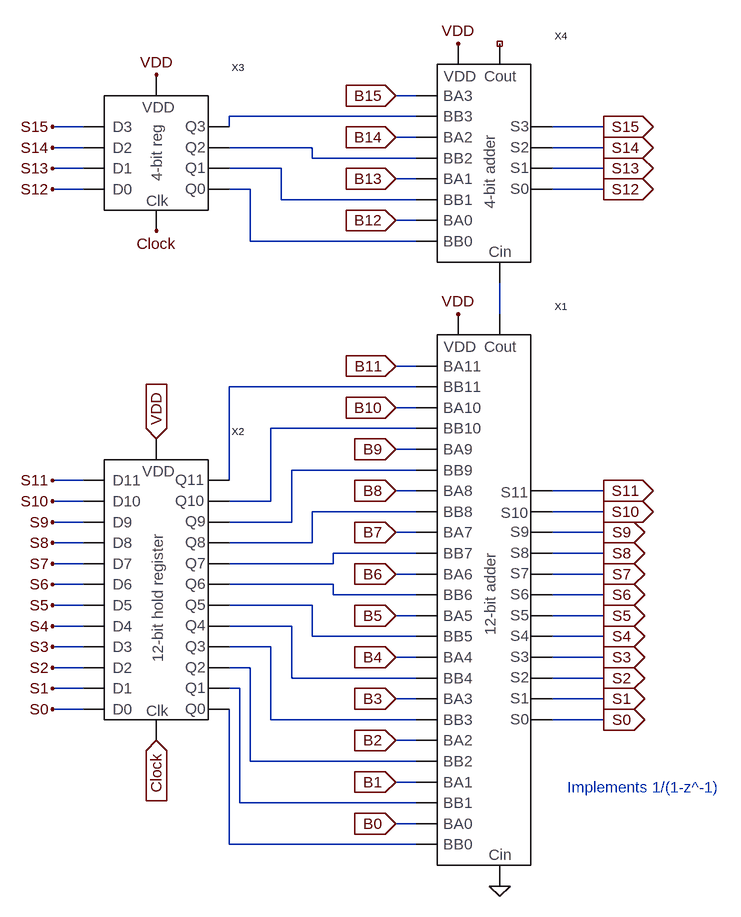
[diagram p0: schematic 16_bit_integrator.asc]
16_bit_integrator.asc, the LTspice schematic file:
Version 4
SHEET 1 1324 932
WIRE 112 -1456 80 -1456
WIRE 112 -1424 -176 -1424
WIRE -400 -1408 -448 -1408
WIRE -176 -1408 -176 -1424
WIRE 400 -1408 320 -1408
WIRE 112 -1392 80 -1392
WIRE -400 -1376 -448 -1376
WIRE -48 -1376 -176 -1376
WIRE 400 -1376 320 -1376
WIRE -48 -1360 -48 -1376
WIRE 112 -1360 -48 -1360
WIRE -400 -1344 -448 -1344
WIRE -96 -1344 -176 -1344
WIRE 400 -1344 320 -1344
WIRE 112 -1328 80 -1328
WIRE -400 -1312 -448 -1312
WIRE -144 -1312 -176 -1312
WIRE 400 -1312 320 -1312
WIRE -96 -1296 -96 -1344
WIRE 112 -1296 -96 -1296
WIRE 112 -1264 80 -1264
WIRE -144 -1232 -144 -1312
WIRE 112 -1232 -144 -1232
WIRE 240 -1120 240 -1168
WIRE 112 -1040 80 -1040
WIRE 112 -1008 -176 -1008
WIRE 112 -976 80 -976
WIRE 112 -944 -112 -944
WIRE 112 -912 80 -912
WIRE 112 -880 -80 -880
WIRE -400 -864 -448 -864
WIRE -176 -864 -176 -1008
WIRE 112 -848 80 -848
WIRE 400 -848 320 -848
WIRE -400 -832 -448 -832
WIRE -112 -832 -112 -944
WIRE -112 -832 -176 -832
WIRE 112 -816 -48 -816
WIRE 400 -816 320 -816
WIRE -400 -800 -448 -800
WIRE -80 -800 -80 -880
WIRE -80 -800 -176 -800
WIRE 112 -784 80 -784
WIRE 400 -784 320 -784
WIRE -400 -768 -448 -768
WIRE -48 -768 -48 -816
WIRE -48 -768 -176 -768
WIRE 112 -752 -16 -752
WIRE 400 -752 320 -752
WIRE -400 -736 -448 -736
WIRE -16 -736 -16 -752
WIRE -16 -736 -176 -736
WIRE 112 -720 80 -720
WIRE 400 -720 320 -720
WIRE -400 -704 -448 -704
WIRE -16 -704 -176 -704
WIRE -16 -688 -16 -704
WIRE 112 -688 -16 -688
WIRE 400 -688 320 -688
WIRE -400 -672 -448 -672
WIRE -48 -672 -176 -672
WIRE 112 -656 80 -656
WIRE 400 -656 320 -656
WIRE -400 -640 -448 -640
WIRE -80 -640 -176 -640
WIRE -48 -624 -48 -672
WIRE 112 -624 -48 -624
WIRE 400 -624 320 -624
WIRE -400 -608 -448 -608
WIRE -112 -608 -176 -608
WIRE 112 -592 80 -592
WIRE 400 -592 320 -592
WIRE -400 -576 -448 -576
WIRE -144 -576 -176 -576
WIRE -80 -560 -80 -640
WIRE 112 -560 -80 -560
WIRE 400 -560 320 -560
WIRE -400 -544 -448 -544
WIRE -160 -544 -176 -544
WIRE 112 -528 80 -528
WIRE 400 -528 320 -528
WIRE -400 -512 -448 -512
WIRE -112 -496 -112 -608
WIRE 112 -496 -112 -496
WIRE 400 -496 320 -496
WIRE 112 -464 80 -464
WIRE -144 -432 -144 -576
WIRE 112 -432 -144 -432
WIRE 112 -400 80 -400
WIRE -160 -368 -160 -544
WIRE 112 -368 -160 -368
WIRE 112 -336 80 -336
WIRE -176 -304 -176 -512
WIRE 112 -304 -176 -304
FLAG 80 -784 B7
IOPIN 80 -784 In
FLAG 80 -720 B6
IOPIN 80 -720 In
FLAG 80 -656 B5
IOPIN 80 -656 In
FLAG 80 -592 B4
IOPIN 80 -592 In
FLAG 80 -528 B3
IOPIN 80 -528 In
FLAG 80 -464 B2
IOPIN 80 -464 In
FLAG 80 -400 B1
IOPIN 80 -400 In
FLAG 80 -336 B0
IOPIN 80 -336 In
FLAG 80 -1040 B11
IOPIN 80 -1040 In
FLAG 80 -976 B10
IOPIN 80 -976 In
FLAG 80 -912 B9
IOPIN 80 -912 In
FLAG 80 -848 B8
IOPIN 80 -848 In
FLAG 176 -1120 VDD
FLAG 240 -240 0
FLAG -288 -928 VDD
IOPIN -288 -928 In
FLAG -288 -464 Clock
IOPIN -288 -464 In
FLAG 400 -848 S11
IOPIN 400 -848 Out
FLAG 400 -816 S10
IOPIN 400 -816 Out
FLAG 400 -784 S9
IOPIN 400 -784 Out
FLAG 400 -752 S8
IOPIN 400 -752 Out
FLAG 400 -720 S7
IOPIN 400 -720 Out
FLAG 400 -688 S6
IOPIN 400 -688 Out
FLAG 400 -656 S5
IOPIN 400 -656 Out
FLAG 400 -624 S4
IOPIN 400 -624 Out
FLAG 400 -592 S3
IOPIN 400 -592 Out
FLAG 400 -560 S2
IOPIN 400 -560 Out
FLAG 400 -528 S1
IOPIN 400 -528 Out
FLAG 400 -496 S0
IOPIN 400 -496 Out
FLAG -448 -864 S11
FLAG -448 -832 S10
FLAG -448 -800 S9
FLAG -448 -768 S8
FLAG -448 -736 S7
FLAG -448 -704 S6
FLAG -448 -672 S5
FLAG -448 -640 S4
FLAG -448 -608 S3
FLAG -448 -576 S2
FLAG -448 -544 S1
FLAG -448 -512 S0
FLAG -288 -1488 VDD
FLAG -288 -1248 Clock
FLAG -448 -1408 S15
FLAG -448 -1376 S14
FLAG -448 -1344 S13
FLAG -448 -1312 S12
FLAG 176 -1536 VDD
FLAG 400 -1408 S15
IOPIN 400 -1408 Out
FLAG 400 -1376 S14
IOPIN 400 -1376 Out
FLAG 400 -1344 S13
IOPIN 400 -1344 Out
FLAG 400 -1312 S12
IOPIN 400 -1312 Out
FLAG 80 -1264 B12
IOPIN 80 -1264 In
FLAG 80 -1328 B13
IOPIN 80 -1328 In
FLAG 80 -1392 B14
IOPIN 80 -1392 In
FLAG 80 -1456 B15
IOPIN 80 -1456 In
SYMBOL 12_bit_adder 144 -272 R0
SYMATTR InstName X1
SYMBOL 12_bit_register -368 -496 R0
SYMATTR InstName X2
SYMBOL 4_bit_register -368 -1280 R0
SYMATTR InstName X3
SYMBOL 4_bit_adder 144 -1200 R0
SYMATTR InstName X4
TEXT 344 -392 Left 0 ;Implements 1/(1-z^-1)

The netlist it stands for:
* 16_bit_integrator.asc
XX1 VDD B0 N017 B1 N016 B2 N015 B3 N014 B4 N013 B5 N012 B6 N011 B7 N010 S0 N005 0 S1 S2 S3 S4 S5 S6 S7 S8 S9 S10 S11 B8 N009 B9 N008 B10 N007 B11 N006 12_bit_adder  ; pins VDD BA0 BB0 BA1 BB1 BA2 BB2 BA3 BB3 BA4 BB4 BA5 BB5 BA6 BB6 BA7 BB7 S0 Cout Cin S1 S2 S3 S4 S5 S6 S7 S8 S9 S10 S11 BA8 BB8 BA9 BB9 BA10 BB10 BA11 BB11
XX2 S0 S1 S2 S3 S4 S5 S6 S7 S8 S9 S10 S11 N017 N016 N015 N014 N013 N012 N011 N010 N009 N008 N007 N006 Clock VDD 12_bit_register  ; pins D0 D1 D2 D3 D4 D5 D6 D7 D8 D9 D10 D11 Q0 Q1 Q2 Q3 Q4 Q5 Q6 Q7 Q8 Q9 Q10 Q11 Clk VDD
XX3 S12 S13 S14 S15 N004 N003 N002 N001 Clock VDD 4_bit_register  ; pins D0 D1 D2 D3 Q0 Q1 Q2 Q3 Clk VDD
XX4 B12 N004 B13 N003 B14 N002 B15 N001 S12 S13 S14 S15 N005 NC_01 VDD 4_bit_adder  ; pins BA0 BB0 BA1 BB1 BA2 BB2 BA3 BB3 S0 S1 S2 S3 Cin Cout VDD
* Implements 1/(1-z^-1)
.backanno
.end